# EAGLE design FLEXIBOARD (EAGLE 9.1.0)
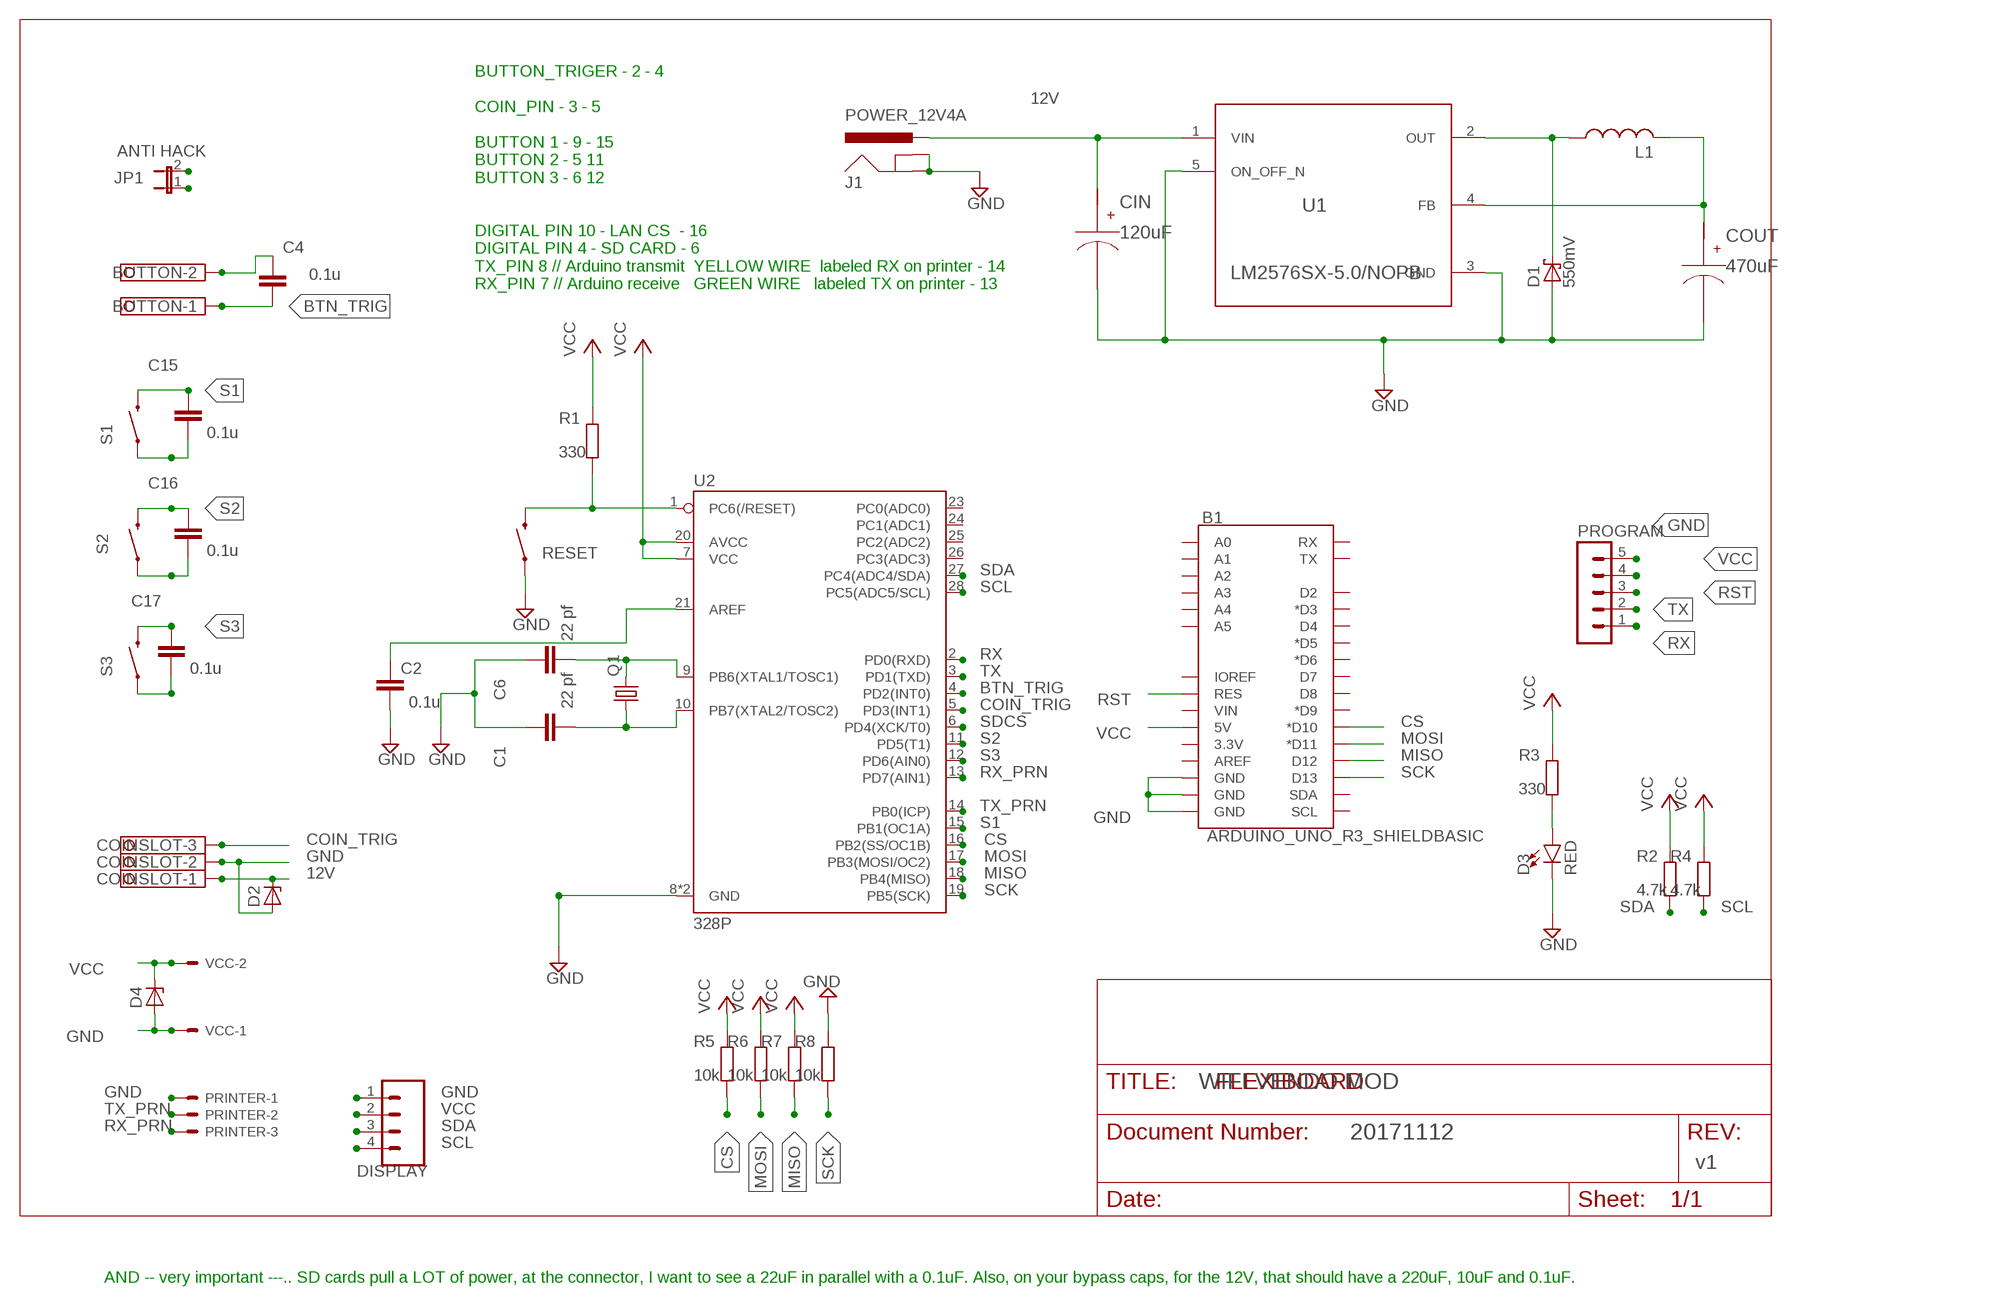
[diagram p0: schematic, sheet 1]

## Parts
B1  ARDUINO_UNO_R3_SHIELDBASIC  [UNO_R3_SHIELD]
BUTTON  TERMINAL-BLOCK-3.5MM-2-PIN-LONG-PAD  [TERMINAL-BLOCK-2-PIN-3.5MM-LONG-PAD]
C1  22 pf  C-EU050-024X044  [C050-024X044]
C2  0.1u  C-EU050-024X044  [C050-024X044]
C4  0.1u  C-EU050-024X044  [C050-024X044]
C6  22 pf  C-EU050-024X044  [C050-024X044]
C15  0.1u  C-EU050-024X044  [C050-024X044]
C16  0.1u  C-EU050-024X044  [C050-024X044]
C17  0.1u  C-EU050-024X044  [C050-024X044]
CIN  120uF  20SVPF120M  [CAPSMT_62_F61_T]
COINSLOT  TERMINAL-BLOCK-3.5MM-3-PIN-LONG-PAD  [TERMINAL-BLOCK-3-PIN-3.5MM-LONG-PAD]
COUT  470uF  EEE-FC1A471P  [SM_RADIAL_G_T]
D1  550mV  SCHOTTKY-DIODEC4111-15  [C4111-15]
D2  ZENER-DIODEF126-12  [F126Z12]
D3  RED  LED5MM  [LED_5MM]
D4  ZENER-DIODEF126-12  [F126Z12]
DISPLAY  M04PTH  [1X04]
J1  POWER_12V4A  POWER_JACKPTH  [POWER_JACK_PTH]
JP1  ANTI HACK  JUMPER-2SMD-NO  [SJ_2S-NO]
L1  L_USF  [INDUCTOR_CDRH127]
PRINTER  JST-XH-03-PIN-LONG-PAD  [JST-XH-03-PACKAGE-LONG-PAD]
PROGRAM  MA05-1  [MA05-1]
Q1  CRYSTALSM49  [SM49]
R1  330  R-EU_0204/7  [0204/7]
R2  4.7k  R-EU_0204/7  [0204/7]
R3  330  R-EU_0204/7  [0204/7]
R4  4.7k  R-EU_0204/7  [0204/7]
R5  10k  R-EU_0204/7  [0204/7]
R6  10k  R-EU_0204/7  [0204/7]
R7  10k  R-EU_0204/7  [0204/7]
R8  10k  R-EU_0204/7  [0204/7]
RESET  SWITCH-MOMENTARY-2PTH_EZ  [TACTILE-PTH-EZ]
S1  SWITCH-MOMENTARY-2PTH_EZ  [TACTILE-PTH-EZ]
S2  SWITCH-MOMENTARY-2PTH_EZ  [TACTILE-PTH-EZ]
S3  SWITCH-MOMENTARY-2PTH_EZ  [TACTILE-PTH-EZ]
U1  LM2576SX-5.0/NOPB  [KTT0005B_T]
U2  328P  ATMEGA328P_PDIP  [DIP28]
VCC  JST-XH-02-PIN-LONG-PAD  [JST-XH-02-PACKAGE-LONG-PAD]

## Nets
12V: CIN.P$1(+) COINSLOT.1 D2.C J1.PWR U1.1(VIN)
BTN_TRIG: BUTTON.1 C4.2 U2.4(PD2(INT0))
COIN_TRIG: COINSLOT.3 U2.5(PD3(INT1))
CS: B1.D10(*D10) R5.1 U2.16(PB2(SS/OC1B))
GND: B1.GND@0(GND) B1.GND@1(GND) B1.GND@2(GND) BUTTON.2 C1.1 C2.2 C4.1 C6.1 C15.2 C16.2 C17.2 CIN.P$2(-) COINSLOT.2 COUT.P$2(-) D1.A D2.A D3.K(C) D4.A DISPLAY.1 J1.GND J1.GNDBREAK PRINTER.1 PROGRAM.5 R8.2 RESET.1 S1.1 S2.1 S3.1 U1.3(GND) U1.5(ON_OFF_N) U2.8(GND) U2.22(GND) VCC.1
MISO: B1.D12 R7.1 U2.18(PB4(MISO))
MOSI: B1.D11(*D11) R6.1 U2.17(PB3(MOSI/OC2))
N$1: C6.2 Q1.2 U2.9(PB6(XTAL1/TOSC1))
N$2: C1.2 Q1.1 U2.10(PB7(XTAL2/TOSC2))
N$4: D1.C L1.1 U1.2(OUT)
N$6: D3.A R3.1
N$7: C2.1 U2.21(AREF)
RST: B1.RES PROGRAM.3 R1.1 RESET.3 U2.1(PC6(/RESET))
RX: JP1.2 PROGRAM.1 U2.2(PD0(RXD))
RX_PRN: PRINTER.3 U2.13(PD7(AIN1))
S1: C15.1 S1.3 U2.15(PB1(OC1A))
S2: C16.1 S2.3 U2.11(PD5(T1))
S3: C17.1 S3.3 U2.12(PD6(AIN0))
SCK: B1.D13 R8.1 U2.19(PB5(SCK))
SCL: DISPLAY.4 R4.1 U2.28(PC5(ADC5/SCL))
SDA: DISPLAY.3 R2.1 U2.27(PC4(ADC4/SDA))
SDCS: U2.6(PD4(XCK/T0))
TX: JP1.1 PROGRAM.2 U2.3(PD1(TXD))
TX_PRN: PRINTER.2 U2.14(PB0(ICP))
VCC: B1.5V COUT.P$1(+) D4.C DISPLAY.2 L1.2 PROGRAM.4 R1.2 R2.2 R3.2 R4.2 R5.2 R6.2 R7.2 U1.4(FB) U2.7(VCC) U2.20(AVCC) VCC.2
Unconnected: B1.3.3V B1.A0 B1.A1 B1.A2 B1.A3 B1.A4 B1.A5 B1.AREF B1.D2 B1.D3(*D3) B1.D4 B1.D5(*D5) B1.D6(*D6) B1.D7 B1.D8 B1.D9(*D9) B1.IOREF B1.RX B1.SCL B1.SDA B1.TX B1.VIN U2.23(PC0(ADC0)) U2.24(PC1(ADC1)) U2.25(PC2(ADC2)) U2.26(PC3(ADC3))

## Notes on the sheet
- BUTTON_TRIGER - 2 - 4
  
  COIN_PIN - 3 - 5
  
  BUTTON 1 - 9 - 15
  BUTTON 2 - 5 11
  BUTTON 3 - 6 12
  
  
  DIGITAL PIN 10 - LAN CS  - 16
  DIGITAL PIN 4 - SD CARD - 6
  TX_PIN 8 // Arduino transmit  YELLOW WIRE  labeled RX on printer - 14
  RX_PIN 7 // Arduino receive   GREEN WIRE   labeled TX on printer - 13
- WIFI VENDO MOD
- 20171112
- SCL
- v1
- AND -- very important ---.. SD cards pull a LOT of power, at the connector, I want to see a 22uF in parallel with a 0.1uF. Also, on your bypass caps, for the 12V, that should have a 220uF, 10uF and 0.1uF.

## Library data of the parts
B1 = SparkFun-Boards:ARDUINO_UNO_R3_SHIELD: Arduino R3 Shield Footprint Shield form compatible with the Arduino Uno R3. SparkFun Products: MG2639 Cellular Shield <https://www.sparkfun.com/products/13120> MIDI Shield <https://www.sparkfun.com/products/12898> R3 Stackable Headers Kit <https://www.sparkfun.com/products/11417>
BUTTON = Rembrandt Electronics - Terminal Block 3-5mm v1-0:TERMINAL-BLOCK-3.5MM-2-PIN: Terminal Block 3.5mm Pitch: 3,5 mm Number of pins: 2 Created by Rembrandt Electronics www.rembrandtelectronics.com
C1 C2 C4 C6 C15-C17 = resistor:C-EU: CAPACITOR, European symbol
CIN = AcceleratedDesigns_Lib:20SVPF120M
COINSLOT = Rembrandt Electronics - Terminal Block 3-5mm v1-0:TERMINAL-BLOCK-3.5MM-3-PIN: Terminal Block 3.5mm Pitch: 3,5 mm Number of pins: 3 Created by Rembrandt Electronics www.rembrandtelectronics.com
COUT = AcceleratedDesigns_Lib:EEE-FC1A471P
D1 = diode:SCHOTTKY-DIODE: Schottky Diode
D2 D4 = diode:ZENER-DIODE: Z-Diode
D3 = SparkFun-LED:LED: LED (Generic) Standard schematic elements and footprints for 5mm, 3mm, 1206, and 0603 sized LEDs. Generic LEDs with no color specified.
DISPLAY = SparkFun-Connectors:M04: Header 4 Standard 4-pin 0.1" header. Use with straight break away headers (SKU : PRT-00116), right angle break away headers (PRT-00553), swiss pins (PRT-00743), machine pins (PRT-00117), and female headers (PRT-00115). Molex polarized connector foot print use with SKU : PRT-08231 with associated crimp pins and housings. 1MM SMD Version SKU: PRT-10208; PROD_ID: CONN-09696
J1 = SparkFun-Connectors:POWER_JACK: Power Jack This is the standard 5.5mm barrel jack for power. The PTH is the most common, proven, reliable, footprint. The Slot footprint only works if the mill layer is transmitted to the PCB fab house so be warned. Mating wall wart : TOL-00298 (and others); PROD_ID: CONN-08197
JP1 = SparkFun-Retired:JUMPER-2: Jumper Basic 0.1" spaced jumper. Use with breakaway headers.
L1 = m-pad-2.1:L_US: Inductors in various packages from: - Sumida - Panasonic - Coilcraft
PRINTER = Rembrandt Electronics - JST XH Connectors v1-0:JST-XH-03-PIN: JST XH Connector 2 Pin Wire to board connector. Pitch: 2,54 mm, (0.100") Number of pins: 3 Created by Rembrandt Electronics www.rembrandtelectronics.com
PROGRAM = con-lstb:MA05-1: PIN HEADER; OC_FARNELL: unknown; OC_NEWARK: unknown
Q1 = crystal:CRYSTAL: CRYSTAL; OC_FARNELL: unknown; OC_NEWARK: unknown
R1-R8 = resistor:R-EU_: RESISTOR, European symbol
RESET S1-S3 = SparkFun-Electromechanical:SWITCH-MOMENTARY-2: Various NO switches- pushbuttons, reed, etc
U1 = AcceleratedDesigns_Lib:LM2576SX-5.0/NOPB
U2 = SparkFun-IC-Microcontroller:ATMEGA328P_PDIP: Atmel 328P Through hole ATMEGA328P uC used in the Arduino 32kb flash, 1k EEPROM, 2k SRAM Datasheet <http://www.sparkfun.com/datasheets/Components/SMD/ATMega328.pdf> SparkFun Products Storefront component: AVR 28 Pin 20MHz 32K 6A/D - ATMega328P <https://www.sparkfun.com/products/9061> (COM-09061) SparkFun Simon Says - Through-Hole Soldering Kit <https://www.sparkfun.com/products/10547> (KIT-10547) SparkFun Learn to Solder - Simon Says <https://www.sparkfun.com/products/13708> (KIT-13708) SparkFun BigTime Watch Kit <https://www.sparkfun.com/products/11734> (KIT-11734) SparkFun ClockIt <https://www.sparkfun.com/products/10930> (KIT-10930) SparkFun Serial Enabled LCD Kit <https://www.sparkfun.com/products/10097> (LCD-10097) SparkFun Simon Tilts - Through Hole Soldering Kit <https://www.sparkfun.com/products/12634> (KIT-12634) SparkFun Frequency Counter Kit <https://www.sparkfun.com/products/10140> (KIT-10140) FabFM Radio Kit <https://www.sparkfun.com/products/11043> (KIT-11043) SparkFun Binary Blaster Kit <https://www.sparkfun.com/products/12037> (KIT-12037) SparkFun Metro-Gnome <https://www.sparkfun.com/products/9236> (KIT-09236) ATmega328 with Arduino Optiboot (Uno) <https://www.sparkfun.com/products/10524> (DEV-10524); PROD_ID: IC-09136
VCC = Rembrandt Electronics - JST XH Connectors v1-0:JST-XH-02-PIN: JST XH Connector 2 Pin Wire to board connector. Pitch: 2,54 mm, (0.100") Number of pins: 2 Created by Rembrandt Electronics www.rembrandtelectronics.com

## Net classes
0 default: width 0.406 mm

## Board
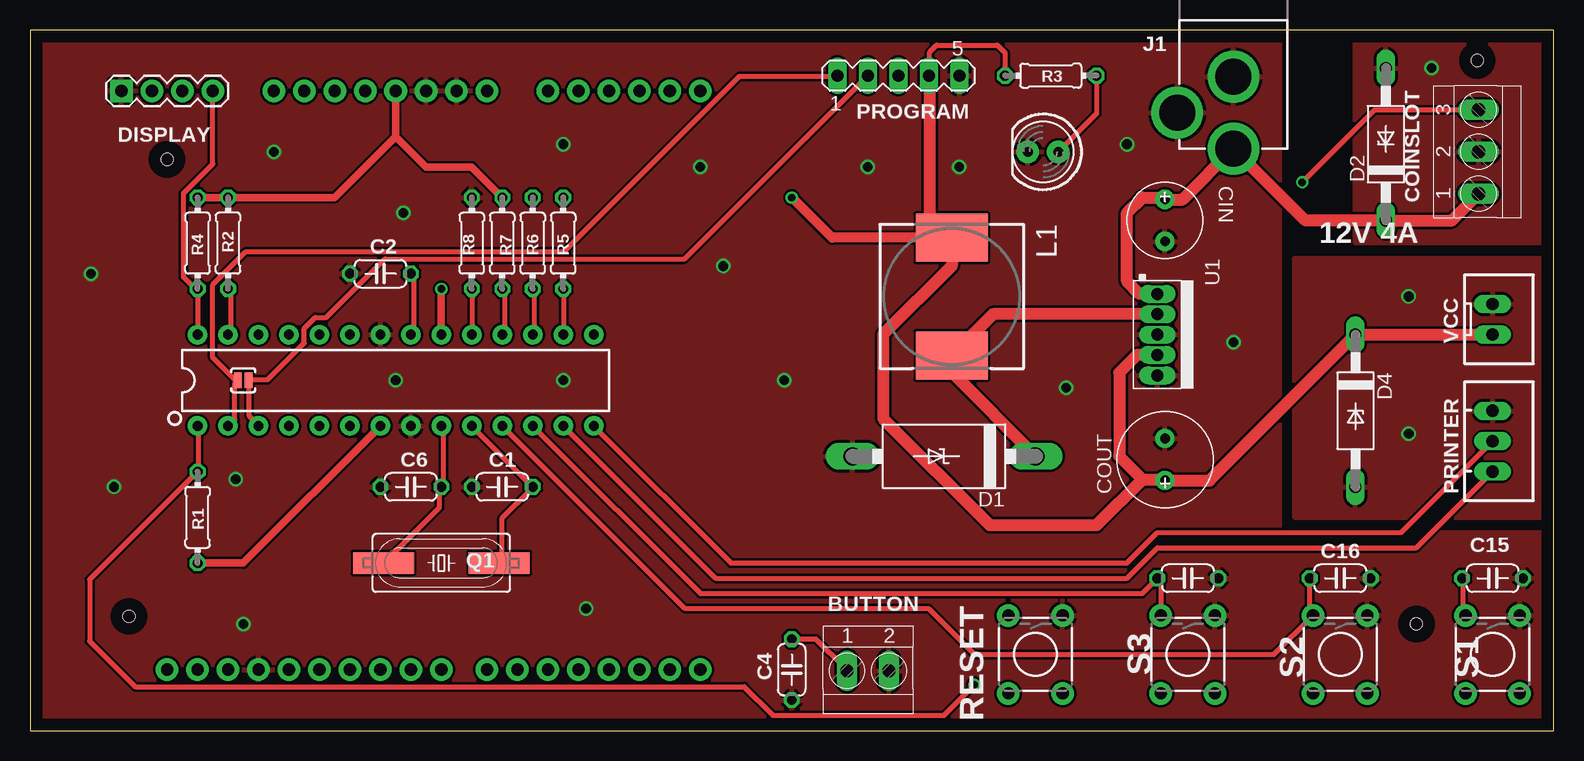
[diagram p1: board, top side]
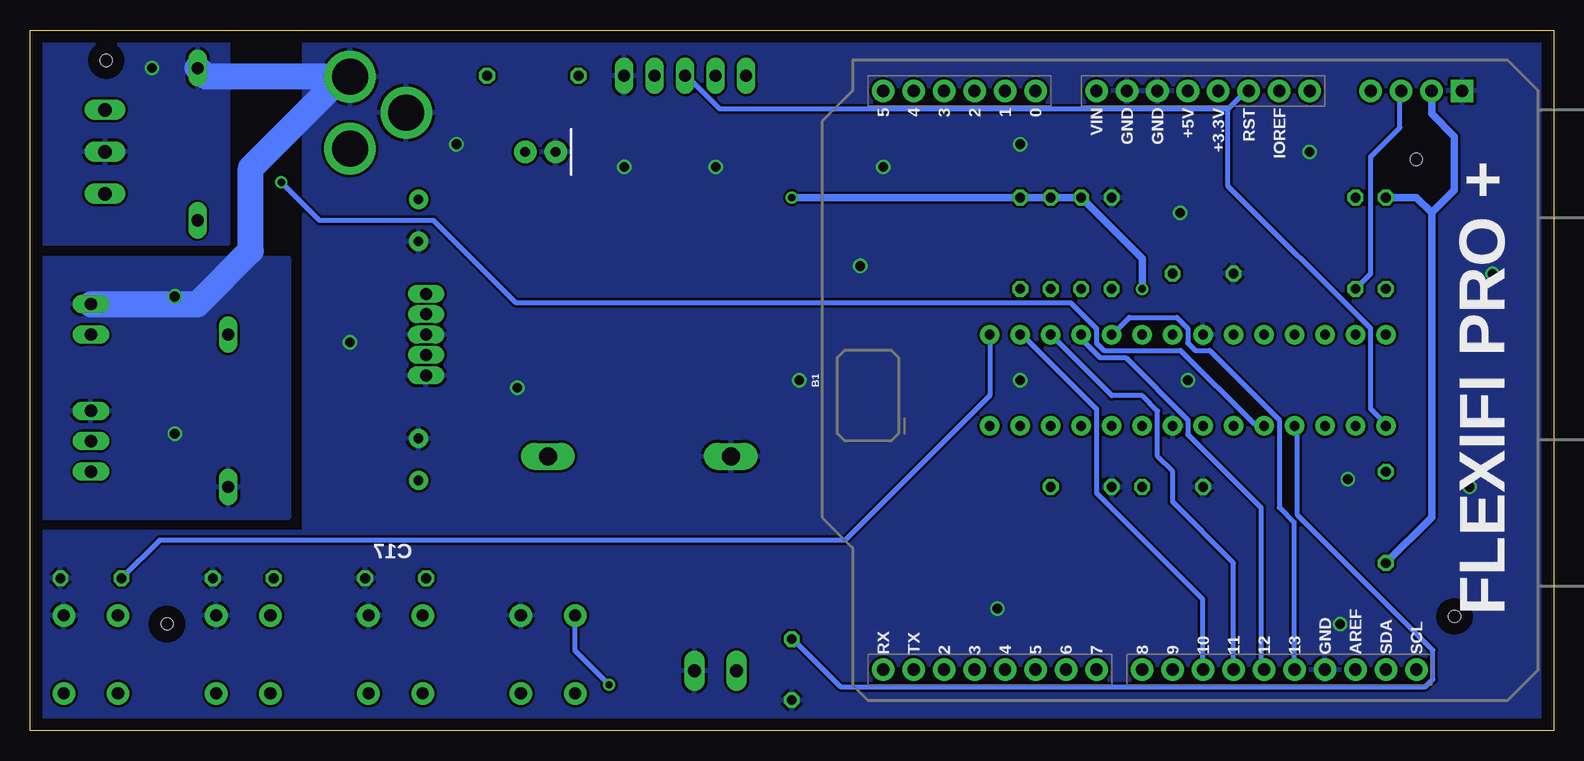
[diagram p2: board, bottom side, seen from below]

Size 127 x 58.42 mm. Coordinates in mm from the lower left corner, seen from the top.
Outline: 0,0 127,0 127,58.42 0,58.42 0,0
Copper layers (1*16): Top 0.035mm / dielectric 1.5mm / Bottom 0.035mm
Design rules "default *": minimum track width 10mil, minimum drill 24mil, track to track 8mil, track to pad 8mil, pad to pad 8mil, via to via 8mil, smd to smd 8mil, copper to edge 40mil, drill to drill 8mil, minimum pad ring 10mil, minimum via ring 8mil, stop-mask expansion 4mil, vias tented up to drill 0mil, thermal gap 10mil
Holes 1 mm at 8.26,9.53 11.43,47.62 115.57,8.89 120.65,55.88

### Footprints (pad centres in the part's own frame; a part is rotated, then mirrored left to right if it is on the bottom)
UNO_R3_SHIELD = drill 1.016 pad 1.88: 3.3V 24.13,-2.54; 5V 24.13,0; A0 24.13,12.7; A1 24.13,15.24; A2 24.13,17.78; A3 24.13,20.32; A4 24.13,22.86; A5 24.13,25.4; AREF -24.13,-13.97; D2 -24.13,20.32; D3 -24.13,17.78; D4 -24.13,15.24; D5 -24.13,12.7; D6 -24.13,10.16; D7 -24.13,7.62; D8 -24.13,3.81; D9 -24.13,1.27; D10 -24.13,-1.27; D11 -24.13,-3.81; D12 -24.13,-6.35; D13 -24.13,-8.89; GND@0 24.13,2.54; GND@1 24.13,5.08; GND@2 -24.13,-11.43; IOREF 24.13,-7.62; NC 24.13,-10.16; RES 24.13,-5.08; RX -24.13,25.4; SCL -24.13,-19.05; SDA -24.13,-16.51; TX -24.13,22.86; VIN 24.13,7.62
TERMINAL-BLOCK-2-PIN-3.5MM-LONG-PAD = drill 1.1 pad 1.7 long: 1 -1.75,-0.1; 2 1.75,-0.1
C050-024X044 = drill 0.813 octagon: 1 -2.54,0; 2 2.54,0
CAPSMT_62_F61_T = drill 0.8 pad 1.6: P$1 -1.75,0; P$2 1.75,0
TERMINAL-BLOCK-3-PIN-3.5MM-LONG-PAD = drill 1.1 pad 1.7 long: 1 -3.5,-0.1; 2 0,-0.1; 3 3.5,-0.1
SM_RADIAL_G_T = drill 0.8 pad 1.6: P$1 -1.75,0; P$2 1.75,0
C4111-15 = drill 1.499 long: A 7.62,0; C -7.62,0
F126Z12 = drill 1.016 long: A 6.35,0; C -6.35,0
LED_5MM = drill 0.813 pad 1.88: A -1.27,0; K 1.27,0
1X04 = drill 1.016 pad 1.88 square: 1 0,0 | drill 1.016 pad 1.88: 2 2.54,0; 3 5.08,0; 4 7.62,0
POWER_JACK_PTH = drill 2.997 pad 4.318: GND 0,7.7; GNDBREAK 4.7,10.7; PWR 0,13.7
SJ_2S-NO = smd 0.635 x 1.27: 1 -0.45,0; 2 0.45,0
INDUCTOR_CDRH127 = smd 6 x 4: 1 0,4.9; 2 0,-4.9
JST-XH-03-PACKAGE-LONG-PAD = drill 1.016 long: 1 -2.54,0; 2 0,0; 3 2.54,0
MA05-1 = drill 1.016 long: 1 -5.08,0; 2 -2.54,0; 3 0,0; 4 2.54,0; 5 5.08,0
SM49 = smd 5.08 x 1.778: 1 -4.826,0; 2 4.826,0
0204/7 = drill 0.813 octagon: 1 -3.81,0; 2 3.81,0
TACTILE-PTH-EZ = drill 1.016 pad 1.88: 1 -3.251,2.261; 2 3.251,2.261; 3 -3.251,-2.261; 4 3.251,-2.261
KTT0005B_T = drill 1 pad 1.27 long: 1 0,3.4; 2 0,1.7; 3 0,0; 4 0,-1.7; 5 0,-3.4
DIP28 = drill 0.813 pad 1.626: 1 -16.51,-3.81; 2 -13.97,-3.81; 3 -11.43,-3.81; 4 -8.89,-3.81; 5 -6.35,-3.81; 6 -3.81,-3.81; 7 -1.27,-3.81; 8 1.27,-3.81; 9 3.81,-3.81; 10 6.35,-3.81; 11 8.89,-3.81; 12 11.43,-3.81; 13 13.97,-3.81; 14 16.51,-3.81; 15 16.51,3.81; 16 13.97,3.81; 17 11.43,3.81; 18 8.89,3.81; 19 6.35,3.81; 20 3.81,3.81; 21 1.27,3.81; 22 -1.27,3.81; 23 -3.81,3.81; 24 -6.35,3.81; 25 -8.89,3.81; 26 -11.43,3.81; 27 -13.97,3.81; 28 -16.51,3.81
JST-XH-02-PACKAGE-LONG-PAD = drill 1.016 long: 1 -1.27,0; 2 1.27,0

### Placement (x,y rotation side)
B1  30.48,29.21 90 bottom
BUTTON  69.85,5.08 0 top
C1  39.37,20.32 0 top
C2  29.21,38.1 180 top
C4  63.5,5.08 90 top
C6  31.75,20.32 0 top
C15  121.92,12.7 0 top
C16  109.22,12.7 0 top
C17  96.52,12.7 0 top
CIN  94.61,42.55 270 top
COINSLOT  120.65,48.26 90 top
COUT  94.61,22.61 90 top
D1  76.2,22.86 180 top
D2  113.03,48.9 90 top
D3  84.45,48.26 180 top
D4  110.49,26.67 270 top
DISPLAY  7.62,53.34 0 top
DRILEGEND  [DRILEGEND]  -32.01,-16.77 0 top  (outside the outline)
J1  100.33,62.23 180 top
JP1  17.78,29.21 180 top
L1  76.83,36.2 180 top
PRINTER  121.92,24.13 270 top
PROGRAM  72.39,54.61 0 top
Q1  34.29,13.97 180 top
R1  13.97,17.78 270 top
R2  16.51,40.64 90 top
R3  85.09,54.61 180 top
R4  13.97,40.64 90 top
R5  44.45,40.64 90 top
R6  41.91,40.64 90 top
R7  39.37,40.64 90 top
R8  36.83,40.64 90 top
RESET  83.82,6.35 270 top
S1  121.92,6.35 270 top
S2  109.22,6.35 270 top
S3  96.52,6.35 270 top
U1  93.98,33.02 0 top
U2  30.48,29.21 0 top
VCC  121.92,34.29 270 top

### Tracks (layer width: path | path; a pad name or v marks a point on that pad's centre or on a via)
12V
  Top 1.016: COINSLOT.1 118.53,42.55 D2.C 106.31,42.55 J1.PWR 96.09,44.3 CIN.P$1 94.46,44.45 92.71,44.45 91.44,43.18 91.44,37.47 92.48,36.42 U1.1
BTN_TRIG
  Top 0.406: C4.2 65.53,7.62 67.97,5.18 BUTTON.1
  Bottom 0.406: U2.4 21.34,25.3 21.34,17.98 10.06,6.71 10.06,4.27 10.67,3.66 59.44,3.66 63.4,7.62 C4.2
COIN_TRIG  (via drill 0.6)
  Top 0.406: v106.05,45.72 112.08,51.76 COINSLOT.3
  Bottom 0.406: U2.5 24.38,25.6 24.99,25.6 31.09,31.7 37.49,31.7 38.1,32.31 38.1,33.53 40.23,35.66 86.46,35.66 93.34,42.55 102.87,42.55 v106.05,45.72
CS
  Top 0.406: R5.1 44.5,36.58 44.5,33.22 U2.16
  Bottom 0.406: B1.D10 29.26,5.18 29.26,10.97 38.1,19.81 38.1,26.82 44.2,32.92 U2.16
GND  (via drill 0.8)
  Bottom 2.184: J1.GND 100.97,54.53 | 100.97,54.53 112.31,54.53 D2.A | VCC.1 113.03,35.56 108.58,40.01 108.58,46.91 100.97,54.53
  other vias: 55.88,46.99 44.45,48.9 20.32,48.26 31.11,43.18 5.08,38.1 6.99,20.32 17.78,8.89 17.14,20.95 46.35,10.16 44.45,29.21 30.48,29.21 57.78,38.73 62.87,29.21 69.85,46.99 77.47,46.99 86.36,28.57 100.33,32.38 114.94,36.2 114.94,24.77 116.84,55.24 91.44,48.9
  pour Top: -31.75,69.85 104.14,69.85 104.14,16.51 138.43,16.51 138.43,-12.7 -31.75,-12.7
  pour Bottom: -25.4,63.5 104.14,63.5 104.14,16.51 132.08,16.51 132.08,-6.35 -25.4,-6.35
  pour Top: 130.81,39.37 105.41,39.37 105.41,17.78 130.81,17.78
  pour Bottom: 105.41,39.37 129.54,39.37 129.54,17.78 105.41,17.78
  pour Top: 110.49,40.64 110.49,59.69 130.81,59.69 130.81,40.64
  pour Bottom: 110.49,59.69 129.54,59.69 129.54,40.64 110.49,40.64
MISO
  Top 0.406: R7.1 39.62,36.58 39.62,33.22 U2.18
  Bottom 0.406: B1.D12 24.38,5.18 24.38,18.59 30.48,24.69 30.48,25.91 35.66,31.09 37.8,31.09 39.62,32.92 U2.18
MOSI
  Top 0.406: R6.1 42.06,36.58 42.06,33.22 U2.17
  Bottom 0.406: B1.D11 26.67,13.97 31.75,19.05 31.75,21.59 33.02,22.86 33.02,26.67 34.29,27.94 36.83,27.94 U2.17
N$1
  Top 0.406: U2.9 34.44,25.3 34.44,20.42 C6.2 34.14,20.12 34.14,18.59 29.57,14.02 Q1.2
N$2
  Top 0.406: U2.10 36.88,25.3 41.76,20.42 C1.2 41.76,20.12 39.32,17.68 39.32,14.02 Q1.1
N$4
  Top 1.016: D1.C 76.83,29.84 L1.1 80.26,34.72 U1.2
N$6
  Top 0.406: 89,54.56 R3.1 88.9,51.44 D3.A
N$7
  Top 0.406: C2.1 32,38.1 32,33.22 U2.21
RST  (via drill 0.6)
  Top 0.406: U2.1 14.02,25.3 14.02,21.64 R1.1 4.98,12.6 4.98,7.44 8.76,3.66 59.54,3.66 61.92,1.27 76.2,1.27 v78.74,3.81
  Bottom 0.406: 27.13,51.82 69.49,51.82 72.24,54.56 PROGRAM.3 | 27.13,51.82 25.6,53.34 B1.RES | 27.13,51.82 27.13,45.41 15.24,33.53 15.24,26.82 14.02,25.6 U2.1 | RESET.3 81.56,6.63 v78.74,3.81
RX
  Top 0.406: U2.2 16.76,25.6 17.07,25.91 17.07,28.96 JP1.2 17.07,29.26 15.24,31.09 15.24,37.19 17.98,39.93 44.5,39.93 59.13,54.56 67.06,54.56 PROGRAM.1
RX_PRN
  Top 0.406: U2.13 57.15,12.7 91.44,12.7 93.98,15.24 115.57,15.24 PRINTER.3
S1
  Top 0.406: C15.1 119.48,12.5 119.48,9.75 S1.3
  Bottom 0.406: U2.15 46.99,27.94 59.05,15.88 116.2,15.88 C15.1
S2
  Top 0.406: C16.1 106.68,9.75 S2.3 103.71,6.35 78.74,6.35 74.93,10.16 54.61,10.16 U2.11
S3
  Top 0.406: U2.12 55.88,11.43 92.71,11.43 C17.1 94.26,12.42 S3.3
SCK
  Top 0.406: R8.1 36.88,36.58 36.88,33.22 U2.19
  Bottom 0.406: B1.D13 21.64,5.18 21.64,17.37 22.86,18.59 22.86,25.91 28.65,31.7 29.87,31.7 30.48,32.31 30.48,33.53 31.39,34.44 35.36,34.44 36.58,33.22 U2.19
SCL
  Top 0.406: U2.28 14.02,33.22 14.02,36.58 R4.1 13.72,36.88 12.8,37.8 12.8,44.81 15.24,47.24 DISPLAY.4
SDA
  Top 0.406: R2.1 16.76,36.58 16.76,33.22 U2.27
  Bottom 0.406: R2.1 15.24,38.1 15.24,47.85 12.8,50.29 12.8,53.34 DISPLAY.3
TX
  Top 0.406: U2.3 18.9,25.6 18.29,26.21 18.29,28.96 JP1.1 18.29,29.26 19.81,29.26 22.86,32.31 22.86,33.53 23.77,34.44 24.69,34.44 29.57,39.32 54.56,39.32 PROGRAM.2
TX_PRN
  Top 0.406: U2.14 58.42,13.97 91.44,13.97 93.98,16.51 114.3,16.51 PRINTER.2
VCC  (via drill 0.6)
  Top 0.406: PROGRAM.4 74.98,54.56 74.98,56.57 75.56,57.15 80.64,57.15 81.28,56.52 R3.2
  Top 0.61: R7.2 36.83,46.99 33.02,46.99 30.48,49.53 | 30.48,49.53 B1.5V | R4.2 R2.2 25.4,44.45 30.48,49.53 | U2.7 17.78,13.97 R1.2 | U2.20 v34.29,36.83
  Top 0.813: L1.2 66.86,41.09 v63.5,44.45
  Top 1.016: 74.98,54.56 74.98,42.95 L1.2 76.83,38.73 71.12,33.02 71.12,26.04 80.01,17.14 88.9,17.14 92.71,20.95 | VCC.2 D4.C 98.33,20.86 COUT.P$1 94.52,20.95 92.71,20.95 | U1.4 92.28,31.32 90.81,29.84 90.81,22.86 92.71,20.95
  Bottom 0.406: 74.98,54.56 PROGRAM.4
  Bottom 0.61: v63.5,44.45 R5.2 R6.2 R7.2 34.29,39.37 v34.29,36.83 | R4.2 11.43,44.45 10.16,43.18 | 10.16,43.18 10.16,17.78 R1.2 | 10.16,43.18 8.26,45.09 8.26,49.53 10.16,51.44 DISPLAY.2

### Text on the board
tPlace: 12V 4A
bPlace: FLEXIFI PRO +
DrillLegend: LAYER-STACK
DrillLegend_01-16: 01-16
DrillLegend_01-20: 01-20